# EAGLE design adau1772-1372-boosterpack (EAGLE 6.3)
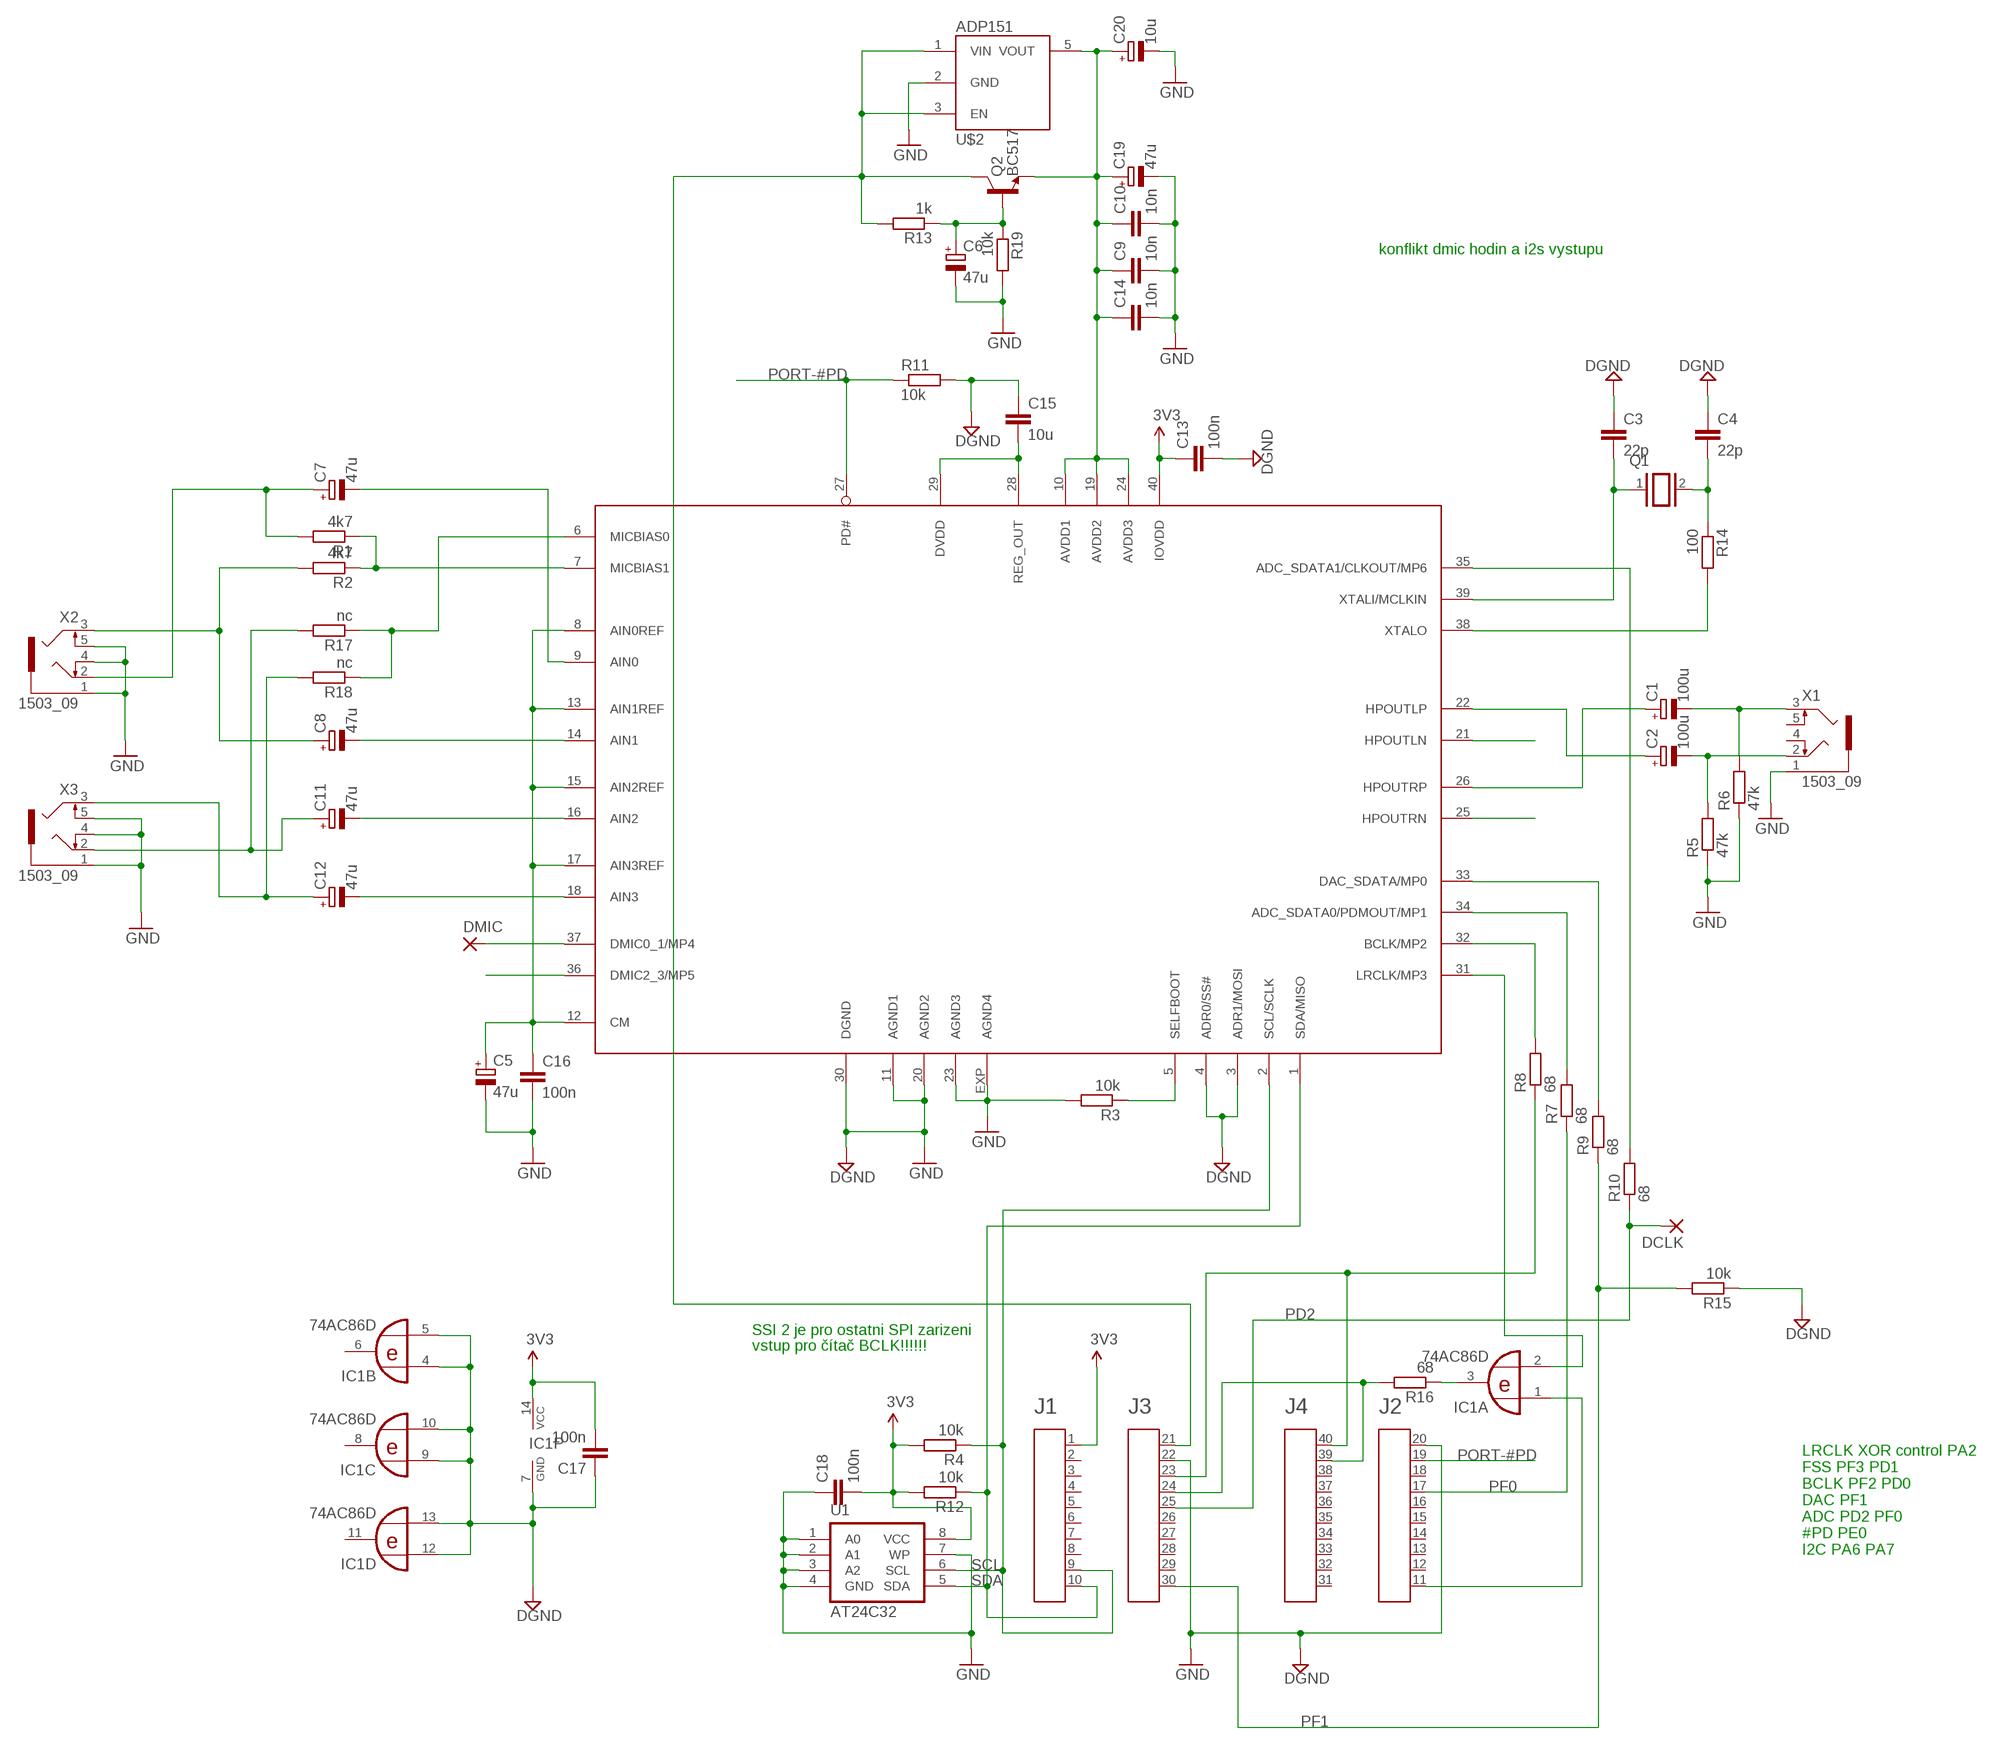
[diagram p0: schematic, sheet 1]

## Parts
A1  HEADER4X10-BOOSTERPACK  [4X10-BOOSTERPACK]
C1  100u  CPOL-EUE2.5-7  [E2,5-7]
C2  100u  CPOL-EUE2.5-7  [E2,5-7]
C3  22p  C-EUC0805K  [C0805K]
C4  22p  C-EUC0805K  [C0805K]
C5  47u  CPOL-EUSMCC  [SMC_C]
C6  47u  CPOL-EUE2-5  [E2-5]
C7  47u  CPOL-EUE2-5  [E2-5]
C8  47u  CPOL-EUE2-5  [E2-5]
C9  10n  C-EUC0805  [C0805]
C10  10n  C-EUC0805  [C0805]
C11  47u  CPOL-EUE2-5  [E2-5]
C12  47u  CPOL-EUE2-5  [E2-5]
C13  100n  C-EUC0805  [C0805]
C14  10n  C-EUC0805  [C0805]
C15  10u  C-EUC0805  [C0805]
C16  100n  C-EUC0805  [C0805]
C17  100n  C-EUC0805  [C0805]
C18  100n  C-EUC0805  [C0805]
C19  47u  CPOL-EUE2-5  [E2-5]
C20  10u  CPOL-EUSMCA  [SMC_A]
DCLK  SMD2  [SMD1,27-2,54]
DMIC  SMD2  [SMD1,27-2,54]
IC1  74AC86D  [SO14]
Q1  XTAL/S  [QS]
Q2  BC517  BC550  [TO92-]
R1  4k7  R-EU_R1206  [R1206]
R2  4k7  R-EU_R1206  [R1206]
R3  10k  R-EU_R1206  [R1206]
R4  10k  R-EU_R0805  [R0805]
R5  47k  R-EU_R0805  [R0805]
R6  47k  R-EU_R0805  [R0805]
R7  68  R-EU_R1206  [R1206]
R8  68  R-EU_R1206  [R1206]
R9  68  R-EU_R1206  [R1206]
R10  68  R-EU_R1206  [R1206]
R11  10k  R-EU_R0805  [R0805]
R12  10k  R-EU_R0805  [R0805]
R13  1k  R-EU_R0805  [R0805]
R14  100  R-EU_R0805  [R0805]
R15  10k  R-EU_R1206  [R1206]
R16  68  R-EU_R1206  [R1206]
R17  nc  R-EU_R1206  [R1206]
R18  nc  R-EU_R1206  [R1206]
R19  10k  R-EU_R0805  [R0805]
U1  AT24C32  AT24CXX  [SO08-8S1]
U$1  ADAU1772  [LFPSC-40]
U$2  ADP151  [SOT23-5]
X1  1503_09  [1503_09]
X2  1503_09  [1503_09]
X3  1503_09  [1503_09]

## Nets
3.3V: A1.1 C13.1 C17.2 C18.2 IC1.14(P:VCC) R4.2 R12.2 U1.8(VCC) U$1.40(IOVDD) ; supply symbol labelled 3V3
GND: A1.20 A1.22 C3.1 C4.1 C5.- C6.- C9.2 C10.2 C13.2 C14.2 C15.1 C16.2 C17.1 C18.1 C19.- C20.- IC1.4(B:I0) IC1.5(B:I1) IC1.7(P:GND) IC1.9(C:I0) IC1.10(C:I1) IC1.12(D:I0) IC1.13(D:I1) R3.2 R5.1 R6.1 R11.2 R15.1 R19.2 U1.1(A0) U1.2(A1) U1.3(A2) U1.4(GND) U1.7(WP) U$1.3(ADR1/MOSI) U$1.4(ADR0/SS#) U$1.11(AGND1) U$1.20(AGND2) U$1.23(AGND3) U$1.30(DGND) U$1.EXP(AGND4) U$2.2(GND) X1.1 X2.1 X2.4 X2.5 X3.1 X3.4 X3.5 ; supply symbol labelled DGND
N$1: C8.+ R2.2 X2.3
N$2: C7.+ R1.2 X2.2
N$3: C12.- U$1.18(AIN3)
N$4: A1.21 Q2.3(C) R13.2 U$2.1(VIN) U$2.3(EN)
N$5: C12.+ R18.2 X3.3
N$6: C11.+ R17.2 X3.2
N$7: IC1.2(A:I1) U$1.31(LRCLK/MP3)
N$8: C9.1 C10.1 C14.1 C19.+ C20.+ Q2.1(E) U$1.10(AVDD1) U$1.19(AVDD2) U$1.24(AVDD3) U$2.5(VOUT)
N$9: C1.+ U$1.26(HPOUTRP)
N$10: R1.1 R2.1 U$1.7(MICBIAS1)
N$11: C2.- R5.2 X1.2
N$12: C1.- R6.2 X1.3
N$13: R8.2 U$1.32(BCLK/MP2)
N$14: C2.+ U$1.22(HPOUTLP)
N$15: R7.2 U$1.34(ADC_SDATA0/PDMOUT/MP1)
N$16: R10.2 U$1.35(ADC_SDATA1/CLKOUT/MP6)
N$17: C3.2 Q1.1 U$1.39(XTALI/MCLKIN)
N$18: C4.2 Q1.2 R14.1
N$19: R14.2 U$1.38(XTALO)
N$20: R9.2 U$1.33(DAC_SDATA/MP0)
N$22: DMIC.1(P) U$1.37(DMIC0_1/MP4)
N$23: C15.2 U$1.28(REG_OUT) U$1.29(DVDD)
N$24: C11.- U$1.16(AIN2)
N$25: R17.1 R18.1 U$1.6(MICBIAS0)
N$26: IC1.3(A:O) R16.1
N$27: A1.11 IC1.1(A:I0)
N$28: A1.24 A1.39 R16.2
N$29: C6.+ Q2.2(B) R13.1 R19.1
N$30: U$1.21(HPOUTLN)
N$31: A1.23 A1.40 R8.1
N$32: U$1.25(HPOUTRN)
N$33: U$1.36(DMIC2_3/MP5)
N$37: R3.1 U$1.5(SELFBOOT)
N$40: C7.- U$1.9(AIN0)
N$41: C8.- U$1.14(AIN1)
PD2: A1.25 DCLK.1(P) R10.1
PF0: A1.17 R7.1
PF1: A1.30 R9.1 R15.2
PORT-#PD: A1.19 R11.1 U$1.27(PD#)
SCL: A1.9 R4.1 U1.6(SCL) U$1.2(SCL/SCLK)
SDA: A1.10 R12.1 U1.5(SDA) U$1.1(SDA/MISO)
VREF: C5.+ C16.1 U$1.8(AIN0REF) U$1.12(CM) U$1.13(AIN1REF) U$1.15(AIN2REF) U$1.17(AIN3REF)
Unconnected: A1.2 A1.3 A1.4 A1.5 A1.6 A1.7 A1.8 A1.12 A1.13 A1.14 A1.15 A1.16 A1.18 A1.26 A1.27 A1.28 A1.29 A1.31 A1.32 A1.33 A1.34 A1.35 A1.36 A1.37 A1.38 IC1.6(B:O) IC1.8(C:O) IC1.11(D:O) X1.4 X1.5

## Notes on the sheet
- konflikt dmic hodin a i2s vystupu
- SSI 2 je pro ostatni SPI zarizeni
- vstup pro čítač BCLK!!!!!!
- LRCLK XOR control PA2
  FSS PF3 PD1
  BCLK PF2 PD0
  DAC PF1
  ADC PD2 PF0
  #PD PE0
  I2C PA6 PA7

## Library data of the parts
A1 = EAGLE_BoosterPack_Library:HEADER4X10-BOOSTERPACK
C1 C2 C5-C8 C11 C12 C19 C20 = rcl:CPOL-EU: POLARIZED CAPACITOR, European symbol
C3 C4 C9 C10 C13-C18 = rcl:C-EU: CAPACITOR, European symbol
DCLK DMIC = wirepad:SMD2: SMD PAD
IC1 = 74xx-eu:74*86: Quad 2-input EXCLUSIVE-OR (XOR) gate
Q1 = special:XTAL/S: CRYSTAL
Q2 = gm-trans:BC550
R1-R19 = rcl:R-EU_: RESISTOR, European symbol
U1 = memory-atmel:AT24CXX: EEPROM SPI bus serial
U$1 = analog-devices:ADAU1772
U$2 = adp151:ADP151
X1-X3 = con-lumberg:1503_09: Jack connectors according to JISC 6560, 3.5 mm Klinkeneinbaukupplung nach JISC 6560, 3,5 mm, 3-polig/ stereo, abgewinkelte Ausführung, mit 2 Öffnern und Lötaugen, für Leiterplatten Rückseitenmontage Source: http://www.lumberg.com/Produkte/PDFs/1503_09.pdf; OC_FARNELL: 1243244; OC_NEWARK: unknown

## Board
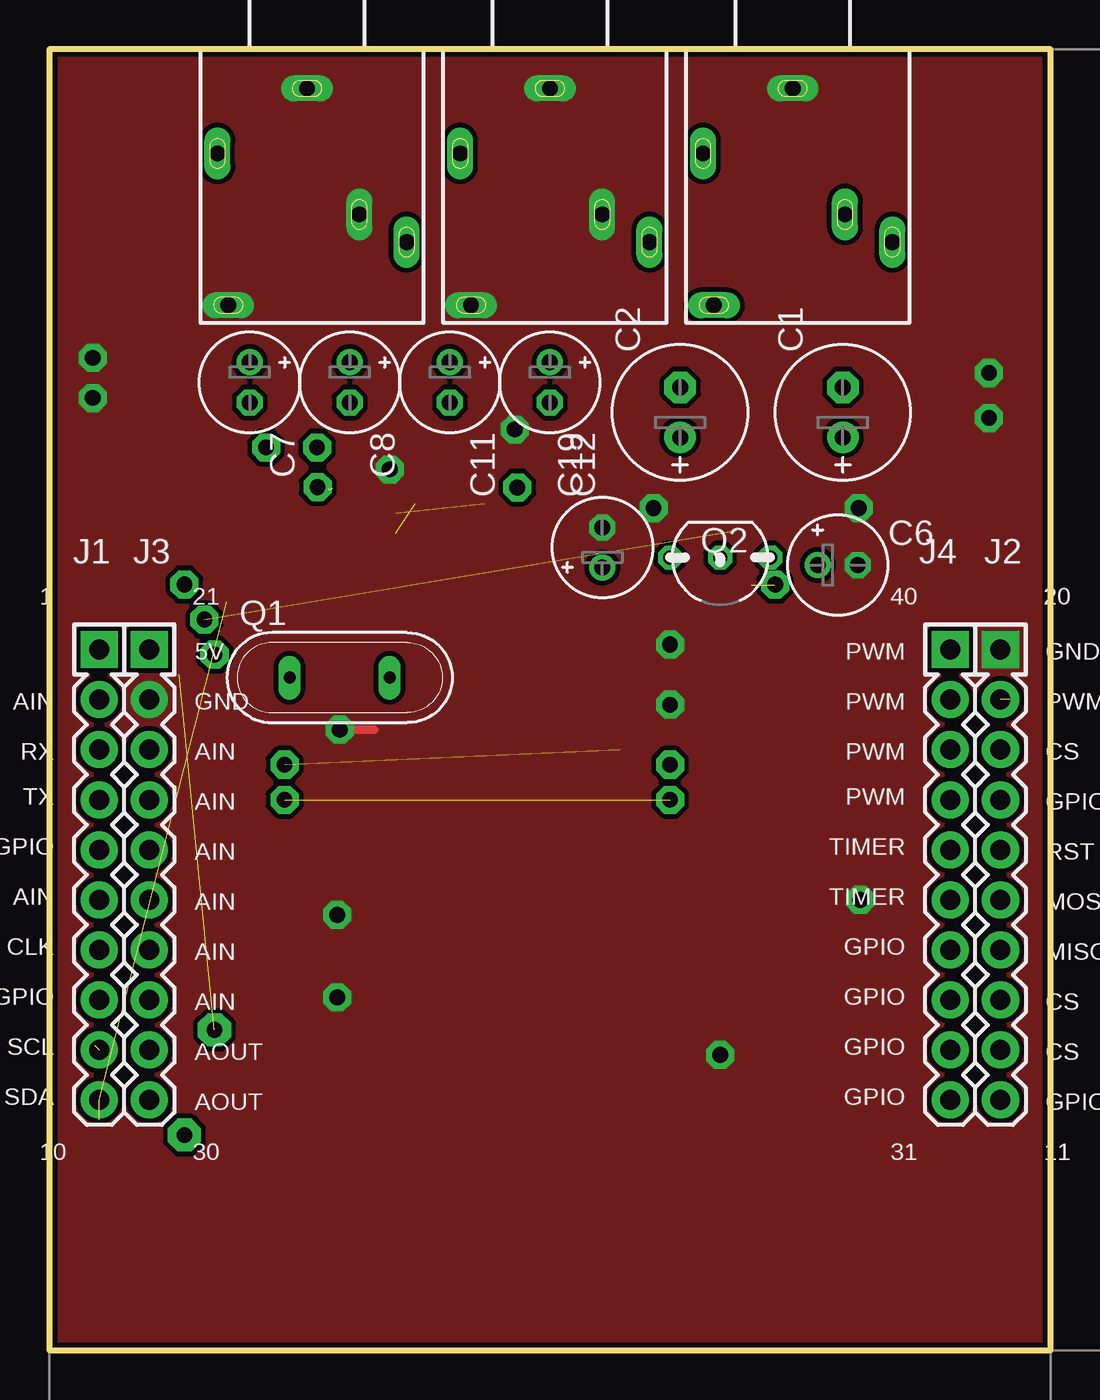
[diagram p1: board, top side]
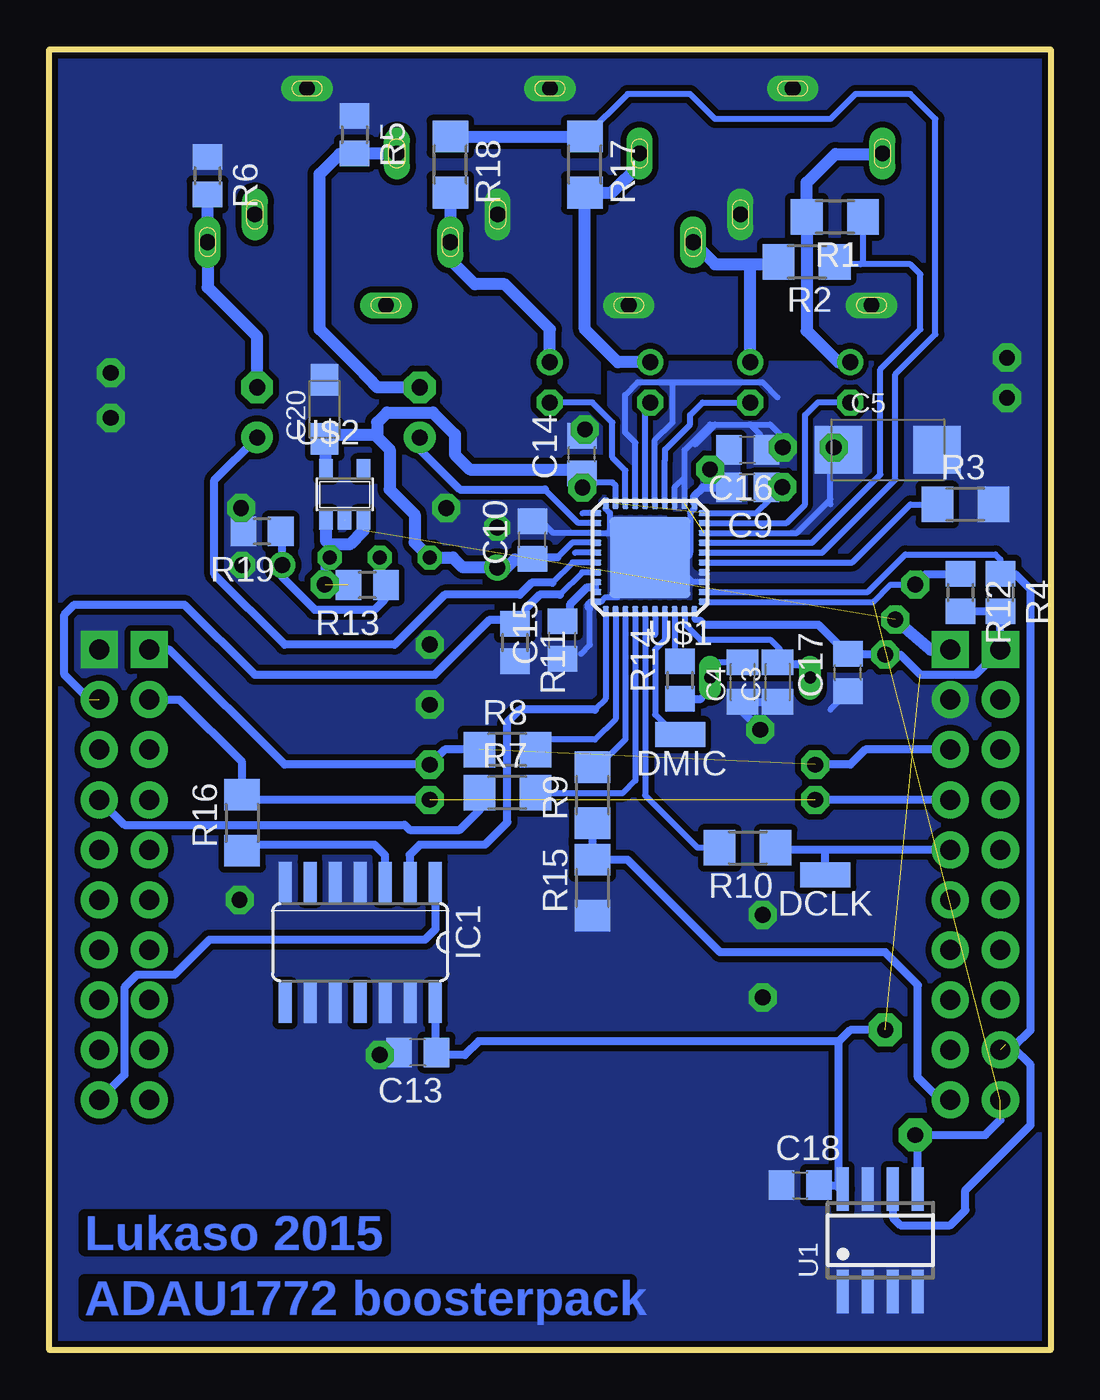
[diagram p2: board, bottom side, seen from below]

Size 50.8 x 66.03 mm. Coordinates in mm from the lower left corner, seen from the top.
Outline: 0,0 50.8,0 50.8,66.03 0,66.03 0,0
Copper layers (1*16): Top 0.035mm / dielectric 1.5mm / Bottom 0.035mm
Design rules "default *": minimum track width 10mil, minimum drill 0.8mm, track to track 10mil, track to pad 8mil, pad to pad 8mil, via to via 8mil, smd to smd 8mil, copper to edge 10mil, drill to drill 8mil, minimum pad ring 10mil, minimum via ring 8mil, stop-mask expansion 4mil, vias tented up to drill 0mil, thermal gap 10mil

### Footprints (pad centres in the part's own frame; a part is rotated, then mirrored left to right if it is on the bottom)
4X10-BOOSTERPACK = drill 1.016 pad 1.88 square: 1 0,10.16; 20 45.72,10.16; 21 2.54,10.16; 40 43.18,10.16 | drill 1.016 pad 1.88: 2 0,7.62; 3 0,5.08; 4 0,2.54; 5 0,0; 6 0,-2.54; 7 0,-5.08; 8 0,-7.62; 9 0,-10.16; 10 0,-12.7; 11 45.72,-12.7; 12 45.72,-10.16; 13 45.72,-7.62; 14 45.72,-5.08; 15 45.72,-2.54; 16 45.72,0; 17 45.72,2.54; 18 45.72,5.08; 19 45.72,7.62; 22 2.54,7.62; 23 2.54,5.08; 24 2.54,2.54; 25 2.54,0; 26 2.54,-2.54; 27 2.54,-5.08; 28 2.54,-7.62; 29 2.54,-10.16; 30 2.54,-12.7; 31 43.18,-12.7; 32 43.18,-10.16; 33 43.18,-7.62; 34 43.18,-5.08; 35 43.18,-2.54; 36 43.18,0; 37 43.18,2.54; 38 43.18,5.08; 39 43.18,7.62
E2,5-7 = drill 0.813 pad 1.6: + -1.27,0 | drill 0.813 pad 1.6 octagon: - 1.27,0
C0805K = smd 1.3 x 1.6: 1 -1,0; 2 1,0
SMC_C = smd 2.4 x 2.4: + -2.5,0; - 2.5,0
E2-5 = drill 0.813 pad 1.27: + -1.016,0 | drill 0.813 pad 1.27 octagon: - 1.016,0
C0805 = smd 1.3 x 1.5: 1 -0.95,0; 2 0.95,0
SMC_A = smd 1.6 x 1.4: + -1.5,0; - 1.5,0
SMD1,27-2,54 = smd 1.27 x 2.54: 1 0,0
SO14 = smd 0.66 x 2.032: 1 -3.81,-3.073; 2 -2.54,-3.073; 3 -1.27,-3.073; 4 0,-3.073; 5 1.27,-3.073; 6 2.54,-3.073; 7 3.81,-3.073; 8 3.81,3.073; 9 2.54,3.073; 10 1.27,3.073; 11 0,3.073; 12 -1.27,3.073; 13 -2.54,3.073; 14 -3.81,3.073
QS = drill 0.61 long: 1 -2.54,0; 2 2.54,0
TO92- = drill 0.7 octagon: 1 2.54,0; 2 0,0; 3 -2.54,0
R1206 = smd 1.6 x 1.803: 1 -1.422,0; 2 1.422,0
R0805 = smd 1.3 x 1.5: 1 -0.95,0; 2 0.95,0
SO08-8S1 = smd 0.6 x 2.2: 1 -1.905,-2.6; 2 -0.635,-2.6; 3 0.635,-2.6; 4 1.905,-2.6; 5 1.905,2.6; 6 0.635,2.6; 7 -0.635,2.6; 8 -1.905,2.6
LFPSC-40 = smd 0.55 x 0.3: 1 -2.75,2.25; 2 -2.75,1.75; 3 -2.75,1.25; 4 -2.75,0.75; 5 -2.75,0.25; 6 -2.75,-0.25; 7 -2.75,-0.75; 8 -2.75,-1.25; 9 -2.75,-1.75; 10 -2.75,-2.25; 21 2.75,-2.25; 22 2.75,-1.75; 23 2.75,-1.25; 24 2.75,-0.75; 25 2.75,-0.25; 26 2.75,0.25; 27 2.75,0.75; 28 2.75,1.25; 29 2.75,1.75; 30 2.75,2.25 | smd 0.3 x 0.55: 11 -2.25,-2.75; 12 -1.75,-2.75; 13 -1.25,-2.75; 14 -0.75,-2.75; 15 -0.25,-2.75; 16 0.25,-2.75; 17 0.75,-2.75; 18 1.25,-2.75; 19 1.75,-2.75; 20 2.25,-2.75; 31 2.25,2.75; 32 1.75,2.75; 33 1.25,2.75; 34 0.75,2.75; 35 0.25,2.75; 36 -0.25,2.75; 37 -0.75,2.75; 38 -1.25,2.75; 39 -1.75,2.75; 40 -2.25,2.75 | smd 4.1 x 4.1: EXP 0,0
SOT23-5 = smd 0.69 x 0.99: 1 -0.95,-1.29; 2 0,-1.29; 3 0.95,-1.29; 4 0.95,1.3; 5 -0.95,1.3
1503_09 = drill 0.8 pad 1.2 long: 1 0,-2.1; 2 -4.55,-5.4; 3 5.05,-9.9; 4 -4,-13.1; 5 2.65,-8.5

### Placement (x,y rotation side)
A1  2.54,25.4 0 top
C1  40.26,47.6 90 top
C2  32,47.6 90 top
C3  13.84,33.91 90 bottom
C4  15.62,33.91 90 bottom
C5  8.26,45.69 0 bottom
C6  40.01,39.85 0 top
C7  10.16,49.12 270 top
C8  15.24,49.12 270 top
C9  15.37,43.79 180 bottom
C10  26.29,41.12 90 bottom
C11  20.32,49.12 270 top
C12  25.4,49.12 270 top
C13  32.11,15.11 180 bottom
C14  23.77,45.47 90 bottom
C15  24.77,36.04 90 bottom
C16  15.37,45.69 180 bottom
C17  10.29,34.39 90 bottom
C18  12.7,8.38 0 bottom
C19  28.07,40.74 90 top
C20  36.83,47.75 90 bottom
DCLK  11.43,24.13 90 bottom
DMIC  18.8,31.24 90 bottom
IC1  35.03,20.7 180 bottom
Q1  14.73,34.14 0 top
Q2  34.04,40.23 180 top
R1  10.95,57.53 180 bottom
R2  12.37,55.24 180 bottom
R3  4.32,42.93 0 bottom
R4  2.54,38.46 270 bottom
R5  35.31,61.7 270 bottom
R6  42.77,59.61 270 bottom
R7  27.56,28.3 0 bottom
R8  27.56,30.48 0 bottom
R9  23.24,28.17 90 bottom
R10  15.37,25.5 180 bottom
R11  27.18,35.92 270 bottom
R12  4.57,38.46 270 bottom
R13  34.67,38.84 180 bottom
R14  18.8,34.01 90 bottom
R15  23.24,23.47 90 bottom
R16  41.02,26.77 90 bottom
R17  23.62,60.17 270 bottom
R18  30.45,60.17 270 bottom
R19  40.01,41.55 180 bottom
U1  8.64,5.59 0 bottom
U$1  20.32,40.23 180 bottom
U$2  35.81,43.43 0 bottom
X1  37.72,66.14 0 top
X2  13.08,66.14 0 top
X3  25.4,66.14 0 top

### Tracks (layer width: path | path; a pad name or v marks a point on that pad's centre or on a via)
3.3V  (via drill 0.8 pad 1.42, 0.8 pad 1.68)  (1 unrouted)
  Bottom 0.305: 3.81,34.29 3.77,34.33 | 10.25,35.31 C17.2 | U$1.40 18.07,37.12 18.03,37.08 17.78,37.08 17.53,36.83
  Bottom 0.406: R12.2 R4.2 A1.1 3.77,34.33 | 17.53,36.83 11.78,36.83 C17.2 | 3.81,34.29 6.6,34.29 7.62,35.31 v8.38,35.31 10.25,35.31 | C18.2 10.73,8.38 10.73,15.68 | 10.73,15.68 10.16,16.26 v8.38,16.26 | IC1.14 31.22,15.17 C13.1 31.03,14.99 29.72,14.99 29.02,15.68 10.73,15.68
  Bottom 0.61: 10.73,8.38 U1.8
GND  (via drill 0.8 pad 1.42)
  Top 0.305: v17.27,44.7 17.78,44.7
  Top 0.406: v14.73,31.5 16.51,31.5
  Bottom 0.305: 10.29,33.4 11.18,32.51 | 19.81,40.13 19.66,39.98 18.8,39.98 18.29,40.49 18.29,42.49 18.07,42.71 U$1.11 | U$1.20 22.57,42.71 22.35,42.49 22.35,41.48 | 22.35,41.48 U$1.23 25.23,41.48 25.78,42.04 | 22.35,41.48 22.18,41.48 22.1,41.4 | U$1.3 18.16,38.98 19.05,39.88 18.8,39.88 18.29,40.39 | 21.97,38.23 22.58,38.23 22.82,37.98 U$1.30 23.36,37.98 23.5,37.85 23.5,37.72 23.37,37.59 | C16.2 16.32,45.66 v17.27,44.7 17.23,44.7 C9.2 | 23.84,35.35 23.37,35.81 23.37,37.59 | 23.37,37.59 23.37,37.69 23.37,37.72
  Bottom 0.406: U$1.11 18.07,43.37 17.65,43.79 C9.2 | C4.1 14.48,32.91 | 14.48,32.91 C3.1 | C17.1 10.29,33.4 | 14.08,32.51 14.48,32.91 | 15.77,32.54 v14.73,31.5
  other vias: 23.62,46.74 34.04,14.99 41.15,22.86 31.5,32.77 14.61,22.1 30.66,42.75 31.5,35.81 47.68,49.61 47.68,47.32 2.21,50.37 2.21,48.34 41.07,42.75 14.61,17.91
  pour Bottom (isolate 0.305, rank 2, no thermals): 0,66.04 50.8,66.04 50.8,0 0,0
  pour Top (isolate 0.254, rank 2, no thermals): 0,66.04 50.8,66.04 50.8,0 0,0
N$1
  Bottom 0.61: C8.+ 15.24,55.12 | 15.24,55.12 14.02,55.12 R2.2 | X2.3 17.02,55.12 15.24,55.12
N$2
  Bottom 0.305: C7.+ 10.77,50.14
  Bottom 0.61: 10.77,50.14 12.37,51.74 R1.2 12.37,59.26 10.92,60.71 8.57,60.71 X2.2
N$3
  Bottom 0.305: U$1.18 21.57,44.66 22.23,45.31 22.23,47.09 23.24,48.11 C12.-
N$4  (via drill 0.8 pad 1.42)  (2 unrouted)
  Bottom 0.406: 36.34,40.47 Q2.3 36.83,39.98 v36.83,38.86 36.8,38.84 | 36.76,41.08 36.58,40.89 | U$2.3 34.86,41.59
  Bottom 0.61: A1.21 6.1,35.56 v7.87,37.08 | U$2.1 36.76,41.08 | Q2.3 36.58,40.89 35.56,40.89 34.86,41.59
N$5
  Bottom 0.305: X3.3
  Bottom 0.61: R18.2 X3.3 | C12.+ 25.4,51.82 27.69,54.1 29.21,54.1 30.23,55.12 30.23,56.02 X3.3
N$6
  Bottom 0.61: C11.+ 21.95,50.14 23.62,51.82 R17.2 22.27,58.75 20.83,60.2 20.83,60.72 X3.2
N$7
  Bottom 0.305: U$1.31 22.57,33.06 23.11,32.51 | 32.51,23.8 IC1.2
  Bottom 0.406: 32.51,23.8 32.51,25.15 32,25.65 28.7,25.65 27.56,26.8 27.56,31.88 26.92,32.51 23.11,32.51
N$8  (via drill 0.8 pad 1.42)  (3 unrouted)
  Bottom 0.305: U$1.10 14.89,42.48 14.89,42.51 14.22,43.18 14.22,43.66 | U$1.19 22.07,43.89 22.23,44.04 23.62,44.04 | U$1.24 24.27,40.98 25.02,40.23 | 23.62,44.04 23.77,44.04 23.88,43.94 23.88,44.41 C14.1 | 14.16,43.72 v13.61,43.81 | v23.75,43.79 23.75,43.92 23.62,44.04
  Bottom 0.406: 14.35,43.72 C9.1 | 25.02,40.23 25.72,40.23
  Bottom 0.61: C14.1 23.96,44.7 29.46,44.7 30.23,45.47 30.23,46.48 31.34,47.6 33.66,47.6 34.16,47.09 34.16,46.48 | 34.16,46.48 34.16,46.35 33.53,45.72 33.53,43.69 32.26,42.42 32.26,41 Q2.1 30.33,40.23 29.82,39.73 C19.+ 27.58,39.73 27.18,40.13 26.33,40.13 C10.1 26.23,40.23 25.72,40.23 | U$2.5 36.76,46.23 | 36.76,46.23 36.76,46.29 36.58,46.48 34.16,46.48 | C20.+ 36.79,46.25 36.76,46.23
N$9
  Bottom 0.305: U$1.26 24.25,39.98 25.27,38.96
  Bottom 0.406: 25.27,38.96 26.31,38.96 26.92,38.35 30.73,38.35 33.27,35.81 38.86,35.81 42.42,39.37 42.42,44.17 C1.+
N$10
  Bottom 0.305: U$1.7 12.1,40.98 8.64,44.45 8.64,49.78 6.6,51.82 6.6,54.61 7.11,55.12 9.65,55.12 | 9.65,55.12 10.82,55.12 R2.1 | R1.1 9.53,55.24 9.65,55.12
N$11
  Bottom 0.61: X1.2 R5.2 35.35,60.71 36.07,60.71 37.08,59.69 37.08,51.82 34.8,49.53 34.65,49.38 34.14,48.87 C2.-
N$12
  Bottom 0.61: C1.- 40.26,51.44 42.77,53.95 X1.3 R6.2
N$13
  Bottom 0.305: U$1.32 22.07,32.03 23.11,30.99 25.65,30.99 25.65,30.96 R8.2 26.01,30.61
N$14
  Bottom 0.305: U$1.22 23.95,41.98 25.65,43.69
  Bottom 0.406: 25.65,43.69 29.97,43.69 32,45.72 C2.+
N$15
  Bottom 0.305: U$1.34 21.07,28.92 21.69,28.3 R7.2
N$16
  Bottom 0.305: U$1.35 20.57,28.16 17.91,25.5 R10.2
N$17
  Bottom 0.305: U$1.39 18.57,36.86 17.78,36.07 14.22,36.07 13.72,35.56 13.72,35.01
  Bottom 0.406: 13.72,35.01 C3.2 13.71,34.8 12.7,34.8 12.19,34.29 Q1.1
N$18
  Bottom 0.305: 17.74,33.06 17.27,33.53 | C4.2 17.16,34.91 | 17.27,34.8 Q1.2
  Bottom 0.406: R14.1 17.74,33.06 | 17.27,33.53 Q1.2 | 17.16,34.91 17.27,34.8
N$19
  Bottom 0.254: 19.07,35.49 18.8,35.49 R14.2
  Bottom 0.305: U$1.38 19.07,35.49
N$20
  Bottom 0.305: U$1.33 21.57,31.01 22.99,29.59
  Bottom 0.406: R9.2 22.99,29.59 | 22.99,29.59
N$22
  Bottom 0.305: U$1.37 19.57,36.06 20.07,35.56 20.07,32.26 19.3,31.5 19.05,31.5 DMIC.1
N$23
  Bottom 0.254: U$1.28 23.07,38.78 23.11,38.73
  Bottom 0.305: U$1.28 U$1.29 | 24.38,37.37 C15.2
  Bottom 0.406: 24.38,37.37 24.38,37.85 23.5,38.73 23.11,38.73
N$24
  Bottom 0.305: U$1.16 20.57,47.86
  Bottom 0.406: 20.57,47.86 C11.-
N$25
  Bottom 0.305: U$1.6 11.59,40.48 7.87,44.2 7.87,49.53 5.84,51.56 5.84,62.48 7.11,63.75 9.91,63.75 11.18,62.48 17.02,62.48 18.29,63.75 21.46,63.75 R17.1
  Bottom 0.61: R18.1 R17.1 23.5,61.59
N$26
  Bottom 0.305: 40.72,25.65 R16.1
  Bottom 0.406: IC1.3 33.76,25.12 34.29,25.65 40.72,25.65
N$27
  Bottom 0.406: IC1.1 31.22,21.36 31.75,20.83 42.67,20.83 44.45,19.05 46.35,19.05 46.99,18.41 46.99,13.97 A1.11
N$28  (via drill 0.8 pad 1.42)  (1 unrouted)
  Top 0.406: 32,27.94 v31.5,27.94
  Bottom 0.406: v31.5,27.94 40.77,27.94 | A1.39 44.2,33.02 41.02,29.84 R16.2 | A1.24 v11.94,27.94
  Bottom 0.61: 40.77,27.94 R16.2
N$29
  Bottom 0.406: Q2.2 34.04,39.15 R13.1 33.78,38.78 33.78,38.1 34.29,37.59 37.34,37.59 38.99,39.24 C6.+ 38.99,41.49 R19.1
N$30
  Bottom 0.305: U$1.21 23.74,42.48
N$31  (via drill 0.8 pad 1.42)  (1 unrouted)
  Bottom 0.406: A1.40 44.7,35.56 38.86,29.72 v31.5,29.72 30.73,30.48 R8.1 | A1.23 9.4,30.48 10.16,29.72 v11.94,29.72
N$32
  Bottom 0.305: U$1.25 24.13,40.48
N$33
  Bottom 0.305: U$1.36 20.07,36.32
N$37
  Bottom 0.305: U$1.5 10.05,39.98 7.11,42.93 R3.1
N$40
  Bottom 0.305: C7.- 11.81,48.11 12.45,47.47 12.45,42.93 13.39,41.98 U$1.9
N$41
  Bottom 0.305: U$1.14 19.57,45.17 19.56,45.17 19.56,45.72 18.29,46.99 18.29,47.47 17.65,48.11 C8.-
PD2
  Bottom 0.305: 13.08,25.4 R10.1
  Bottom 0.406: A1.25 11.43,25.4 | 11.43,25.4 13.08,25.4 | DCLK.1 11.43,25.4
PF0
  Bottom 0.305: 28.96,28.02 28.96,28.27
  Bottom 0.406: A1.17 46.99,26.67 32.77,26.67 32.51,26.42 29.97,26.42 28.96,27.43 28.96,28.02 | 28.96,28.27 28.98,28.27 R7.1
PF1
  Bottom 0.406: R9.1 R15.2 | A1.30 5.59,12.7 6.73,13.84 6.73,18.54 8.38,20.19 16.76,20.19 21.46,24.89 R15.2 | R15.2
PORT-#PD  (1 unrouted)
  Bottom 0.305: U$1.27 23.76,39.48 24.89,38.35 | 26.67,37.08 26.96,37.08 R11.1
  Bottom 0.406: 48.77,33.02 50.04,34.29 50.04,37.34 49.53,37.85 43.94,37.85 40.39,34.29 31.24,34.29 28.45,37.08 27.21,37.08 27.21,36.9 R11.1 | 24.89,38.35 25.91,38.35 26.67,37.59 26.67,37.08
SCL  (1 unrouted)
  Bottom 0.305: U$1.2 9.27,38.48 7.37,40.39 2.79,40.39 2.54,40.13 R4.1
  Bottom 0.406: R4.1 2.5,39.37 1.78,39.37 1.02,38.61 1.02,16.26 1.91,15.37 | U1.6 8,6.73 7.62,6.35 5.08,6.35 4.32,7.11 4.32,8.13 1.02,11.43 1.02,14.48 1.91,15.37 | 1.91,15.37 2.03,15.49 2.29,15.49
SDA  (via drill 0.8 pad 1.42, 0.8 pad 1.68)  (2 unrouted)
  Bottom 0.305: U$1.1 9.01,37.98 8.13,38.86 v6.86,38.86
  Bottom 0.406: R12.1 4.61,39.37 6.35,39.37 v6.86,38.86 | v6.86,10.92 3.3,10.92 2.54,11.68 | U1.5 6.73,10.79
  Bottom 0.61: 6.73,10.79 v6.86,10.92
VREF  (via drill 0.8 pad 1.42)  (1 unrouted)
  Bottom 0.305: U$1.17 21.07,46.06 21.59,46.58 21.59,48.49 20.95,49.12 19.18,49.12 | 19.18,49.12 14.61,49.12 13.84,48.36 | U$1.15 20.07,46.2 19.18,47.09 19.18,49.12 | 18.57,44.3 U$1.12 18.57,45.69 17.27,46.99 14.22,46.99 13.72,46.48 | U$1.13 19.07,43.8 18.57,44.3 | 18.57,44.3 18.57,44.42 | 18.03,45.97 17.02,46.99 15.24,46.99 14.73,46.48 14.73,46.01 C16.1 13.97,45.7 | 11.18,42.93 11.18,43.18 | 11.18,43.18 11.18,45.64 v11,45.82 | U$1.8 12.87,41.48 11.18,43.18
  Bottom 0.406: 11.01,45.78 v11,45.82
  other vias: 13.59,45.82
  pour Bottom (isolate 0.254, no thermals): 22.35,42.16 19.56,42.16 18.54,41.15 11.68,41.15 8.89,43.94 8.89,50.04 22.35,50.04

### Text on the board
Bottom: Lukaso 2015 | ADAU1772 boosterpack